# Altium schematic sheet LDO.SchDoc
size A
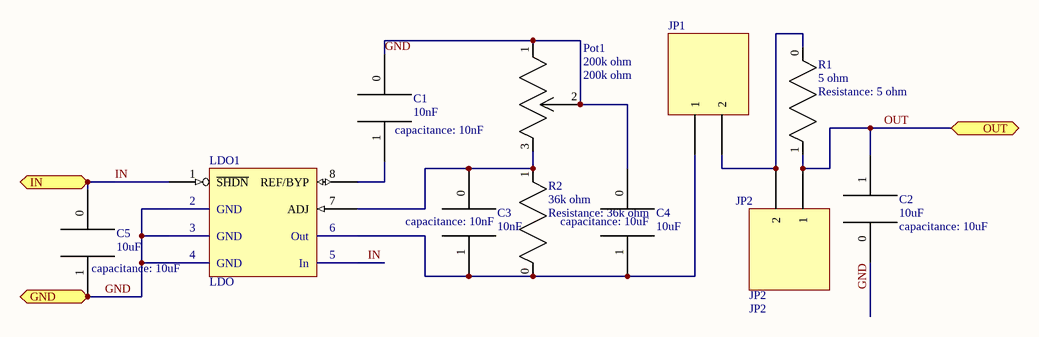
[diagram p0: LDO.SchDoc]

## Parts
C1  10nF  [Capacitor]
C2  10uF  [Capacitor]
C3  10nF  [Capacitor]
C4  10uF  [Capacitor]
C5  10uF  [Capacitor]
JP1  JP2  [JUMPER2]
JP2  JP2  [JUMPER2]
LDO1  LDO  [LT3060]
Pot1  200k ohm  [Pot]
R1  5 ohm  [Resistor]
R2  36k ohm  [Resistor]

## Ports
GND, IN, OUT

## Nets
GND: C1.0 C2.0 C4.0 C5.1 LDO1.2(GND) LDO1.3(GND) LDO1.4(GND) Pot1.1 Pot1.2 ; port GND
IN: C5.0 LDO1.1(~{SHDN}) LDO1.5(In) ; port IN
OUT: C2.1 JP2.1 R1.1 ; port OUT
NetC1_1: C1.1 LDO1.8(REF/BYP)
NetC3_0: C3.0 LDO1.7(ADJ) Pot1.3 R2.1
NetC3_1: C3.1 C4.1 JP1.1 LDO1.6(Out) R2.0
NetJP1_2: JP1.2 JP2.2 R1.0

## Library data of the parts
C1-C5 = cap: 0603cap; Rule: UNIONINDEX{}0[]RULEKIND{}SolderMaskExpansion[]NETSCOPE{}AnyNet[]LAYERKIND{}SameLayer[]NAME{}Schematic Solder Mask Expansion[]EXPANSION{}5mil[]UNIT{}Imperial[]PcbType{}ProtelPcb
  C1 C3: capacitance: 10nF
  C2 C4 C5: capacitance: 10uF
JP1 JP2 = Jumper_2: Rule: UNIONINDEX{}0[]RULEKIND{}SolderMaskExpansion[]NETSCOPE{}AnyNet[]LAYERKIND{}SameLayer[]NAME{}Schematic Solder Mask Expansion[]EXPANSION{}5mil[]UNIT{}Imperial[]PcbType{}ProtelPcb
LDO1 = LT3060: LT3060 LDO; Rule: UNIONINDEX{}0[]RULEKIND{}SolderMaskExpansion[]NETSCOPE{}AnyNet[]LAYERKIND{}SameLayer[]NAME{}Schematic Solder Mask Expansion[]EXPANSION{}5mil[]UNIT{}Imperial[]PcbType{}ProtelPcb
Pot1 = Pot: Variable Resistor; Rule: UNIONINDEX{}0[]RULEKIND{}SolderMaskExpansion[]NETSCOPE{}AnyNet[]LAYERKIND{}SameLayer[]NAME{}Schematic Solder Mask Expansion[]EXPANSION{}5mil[]UNIT{}Imperial[]PcbType{}ProtelPcb; Resistance: 200k ohm
R1 R2 = res: 0603Res; Rule: UNIONINDEX{}0[]RULEKIND{}SolderMaskExpansion[]NETSCOPE{}AnyNet[]LAYERKIND{}SameLayer[]NAME{}Schematic Solder Mask Expansion[]EXPANSION{}5mil[]UNIT{}Imperial[]PcbType{}ProtelPcb
  R1: Resistance: 5 ohm
  R2: Resistance: 36k ohm